# Altium schematic sheet st-link.SchDoc
size A3
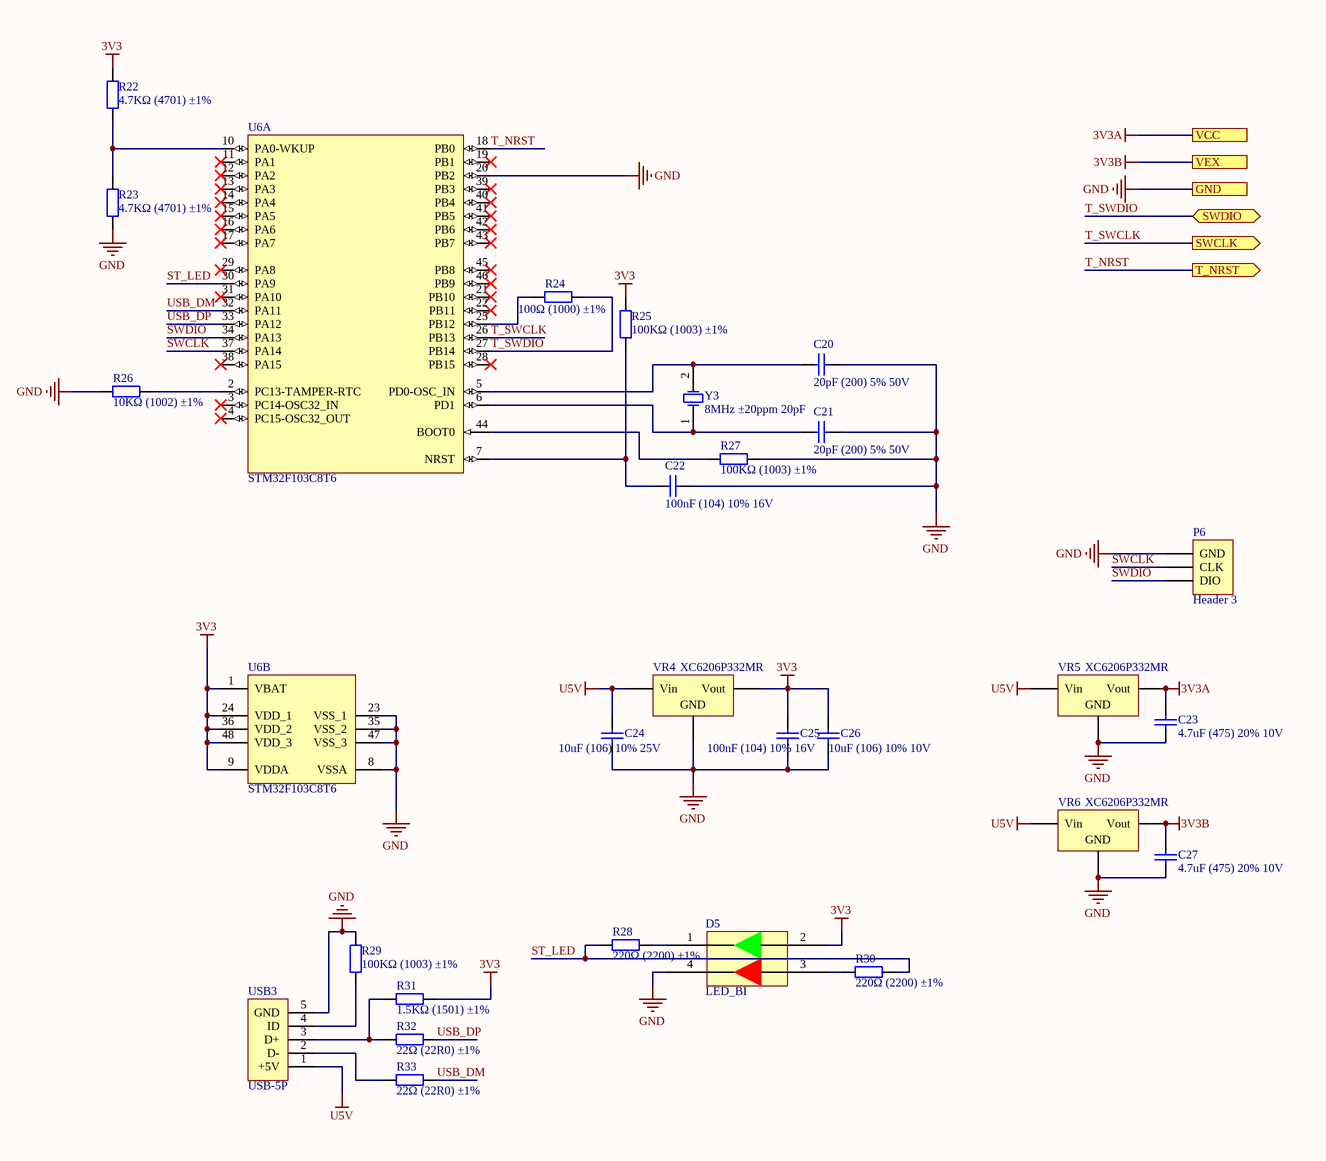
[diagram p0: st-link.SchDoc]

## Parts
C20  20pF (200) 5% 50V  [0402_C]
C21  20pF (200) 5% 50V  [0402_C]
C22  100nF (104) 10% 16V  [0402_C]
C23  4.7uF (475) 20% 10V  [0402_C]
C24  10uF (106) 10% 25V  [0805_C]
C25  100nF (104) 10% 16V  [0402_C]
C26  10uF (106) 10% 10V  [0603_C]
C27  4.7uF (475) 20% 10V  [0402_C]
D5  LED_BI  [LED_BI]
P6  Header 3  [HDR1X3]
R22  4.7KΩ (4701) ±1%  [0402_R]
R23  4.7KΩ (4701) ±1%  [0402_R]
R24  100Ω (1000) ±1%  [0402_R]
R25  100KΩ (1003) ±1%  [0402_R]
R26  10KΩ (1002) ±1%  [0402_R]
R27  100KΩ (1003) ±1%  [0402_R]
R28  220Ω (2200) ±1%  [0402_R]
R29  100KΩ (1003) ±1%  [0402_R]
R30  220Ω (2200) ±1%  [0402_R]
R31  1.5KΩ (1501) ±1%  [0402_R]
R32  22Ω (22R0) ±1%  [0402_R]
R33  22Ω (22R0) ±1%  [0402_R]
U6  STM32F103C8T6  [LQFP-48_7x7x05P]  (parts A,B of 2)
USB3  USB-5P  [USB-MICRO_D]
VR4  XC6206P332MR  [SOT-23-3L]
VR5  XC6206P332MR  [SOT-23-3L]
VR6  XC6206P332MR  [SOT-23-3L]
Y3  8MHz ±20ppm 20pF  [SMD-5032_2P]

## Ports
GND, SWCLK (out), SWDIO (bidir), T_NRST (out), VCC, VEX

## Nets
3V3: C25.2 C26.2 D5.2 R22.2 R25.2 R31.2 U6.1(VBAT) U6.9(VDDA) U6.24(VDD_1) U6.36(VDD_2) U6.48(VDD_3) VR4.2(Vout)
3V3A: C23.2 VR5.2(Vout) ; port VCC
3V3B: C27.2 VR6.2(Vout) ; port VEX
GND: C20.2 C21.2 C22.1 C23.1 C24.1 C25.1 C26.1 C27.1 D5.4 P6.1(GND) R23.1 R26.1 R27.2 R29.2 U6.8(VSSA) U6.20(PB2) U6.23(VSS_1) U6.35(VSS_2) U6.47(VSS_3) USB3.5(GND) VR4.1(GND) VR5.1(GND) VR6.1(GND) ; port GND
U5V: C24.2 USB3.1(+5V) VR4.3(Vin) VR5.3(Vin) VR6.3(Vin)
ST_LED: R28.1 R30.2 U6.30(PA9)
SWCLK: P6.2(CLK) U6.37(PA14)
SWDIO: P6.3(DIO) U6.34(PA13)
T_NRST: U6.18(PB0) ; port T_NRST
T_SWCLK: U6.26(PB13) ; port SWCLK
T_SWDIO: R24.2 U6.27(PB14) ; port SWDIO
USB_DM: R33.2 U6.32(PA11)
USB_DP: R32.2 U6.33(PA12)
NetC20_1: C20.1 U6.5(PD0-OSC_IN) Y3.2(OSC2)
NetC21_1: C21.1 U6.6(PD1) Y3.1(OSC1)
NetC22_2: C22.2 R25.1 U6.7(NRST)
NetD5_1: D5.1 R28.2
NetD5_3: D5.3 R30.1
NetR22_1: R22.1 R23.2 U6.10(PA0-WKUP)
NetR24_1: R24.1 U6.25(PB12)
NetR26_2: R26.2 U6.2(PC13-TAMPER-RTC)
NetR27_1: R27.1 U6.44(BOOT0)
NetR29_1: R29.1 USB3.4(ID)
NetR31_1: R31.1 R32.1 USB3.3(D+)
NetR33_1: R33.1 USB3.2(D-)

Not connected (* = marked no-connect by the designer): U6 3(PC14-OSC32_IN)* 4(PC15-OSC32_OUT)* 11(PA1)* 12(PA2)* 13(PA3)* 14(PA4)* 15(PA5)* 16(PA6)* 17(PA7)* 19(PB1)* 21(PB10)* 22(PB11)* 28(PB15)* 29(PA8)* 31(PA10)* 38(PA15)* 39(PB3)* 40(PB4)* 41(PB5)* 42(PB6)* 43(PB7)* 45(PB8)* 46(PB9)*

## Library data of the parts
C20 C21 = 0402 20pF (200) 5% 50V: 贴片电容; ComponentLink1Description: 供应商链接; ComponentLink1URL: http://www.szlcsc.com/product/details_1906.html; Package: 0402; Supplier: LC; SuppliersPartNumber: C1554
C22 C25 = 0402 100nF (104) 10% 16V: 贴片电容; ComponentLink1Description: 供应商链接; ComponentLink1URL: http://www.szlcsc.com/product/details_1877.html; Package: 0402; Supplier: LC; SuppliersPartNumber: C1525
C23 C27 = 0402 4.7uF (475) 20% 10V: 贴片电容; ComponentLink1Description: 供应商链接; ComponentLink1URL: http://www.szlcsc.com/product/details_24469.html; Package: 0402; Supplier: LC; SuppliersPartNumber: C23733
C24 = 0805 10uF (106) 10% 25V: 贴片电容; ComponentLink1Description: 供应商链接; ComponentLink1URL: http://www.szlcsc.com/product/details_16532.html; Package: 0805; Supplier: LC; SuppliersPartNumber: C15850
C26 = 0603 10uF (106) 10% 10V: 贴片电容; ComponentLink1Description: 供应商链接; ComponentLink1URL: http://www.szlcsc.com/product/details_20411.html; Package: 0603; Supplier: LC; SuppliersPartNumber: C19702
P6 = Header 3: Header, 3-Pin; LatestRevisionDate: 17-Jul-2002; LatestRevisionNote: Re-released for DXP Platform.; Publisher: Altium Limited
R22 R23 = 0402 4.7KΩ (4701) 1%: 贴片电阻; ComponentLink1Description: 供应商链接; ComponentLink1URL: http://www.szlcsc.com/product/details_26643.html; Package: 0402; Supplier: LC; SuppliersPartNumber: C25900
R24 = 0402 100Ω (1000) 1%: 贴片电阻; ComponentLink1Description: 供应商链接; ComponentLink1URL: http://www.szlcsc.com/product/details_25819.html; Package: 0402; Supplier: LC; SuppliersPartNumber: C25076
R25 R27 R29 = 0402 100KΩ (1003) 1%: 贴片电阻; ComponentLink1Description: 供应商链接; ComponentLink1URL: http://www.szlcsc.com/product/details_26484.html; Package: 0402; Supplier: LC; SuppliersPartNumber: C25741
R26 = 0402 10KΩ (1002) 1%: 贴片电阻; ComponentLink1Description: 供应商链接; ComponentLink1URL: http://www.szlcsc.com/product/details_26487.html; Package: 0402; Supplier: LC; SuppliersPartNumber: C25744
R28 R30 = 0402 220Ω (2200) 1%: 贴片电阻; ComponentLink1Description: 供应商链接; ComponentLink1URL: http://www.szlcsc.com/product/details_25834.html; Package: 0402; Supplier: LC; SuppliersPartNumber: C25091
R31 = 0402 1.5KΩ (1501) 1%: 贴片电阻; ComponentLink1Description: 供应商链接; ComponentLink1URL: http://www.szlcsc.com/product/details_26610.html; Package: 0402; Supplier: LC; SuppliersPartNumber: C25867
R32 R33 = 0402 22Ω (22R0) 1%: 贴片电阻; ComponentLink1Description: 供应商链接; ComponentLink1URL: http://www.szlcsc.com/product/details_25835.html; Package: 0402; Supplier: LC; SuppliersPartNumber: C25092
U6 = STM32F103C8T6: ARM; ComponentLink1Description: 供应商链接; ComponentLink1URL: http://www.szlcsc.com/product/details_9243.html; Package: LQFP-48_7x7x05P; Supplier: LC; SuppliersPartNumber: C8734
USB3 = USB-5P: 微型USB母座; 版权归属: 源创客; BOM名称: 微型USB母座; 学习资源: www.ooocke.com
VR4-VR6 = SOT-23 XC6206P332MR: 低压差线性稳压(LDO); ComponentLink1Description: 供应商链接; ComponentLink1URL: http://www.szlcsc.com/product/details_5896.html; Package: SOT-23; Supplier: LC; SuppliersPartNumber: C5446
Y3 = SMD-5032_2P 8MHz 20ppm 20pF: 贴片晶振; ComponentLink1Description: 供应商链接; ComponentLink1URL: http://www.szlcsc.com/product/details_117214.html; Package: SMD-5032_2P; Supplier: LC; SuppliersPartNumber: C115962